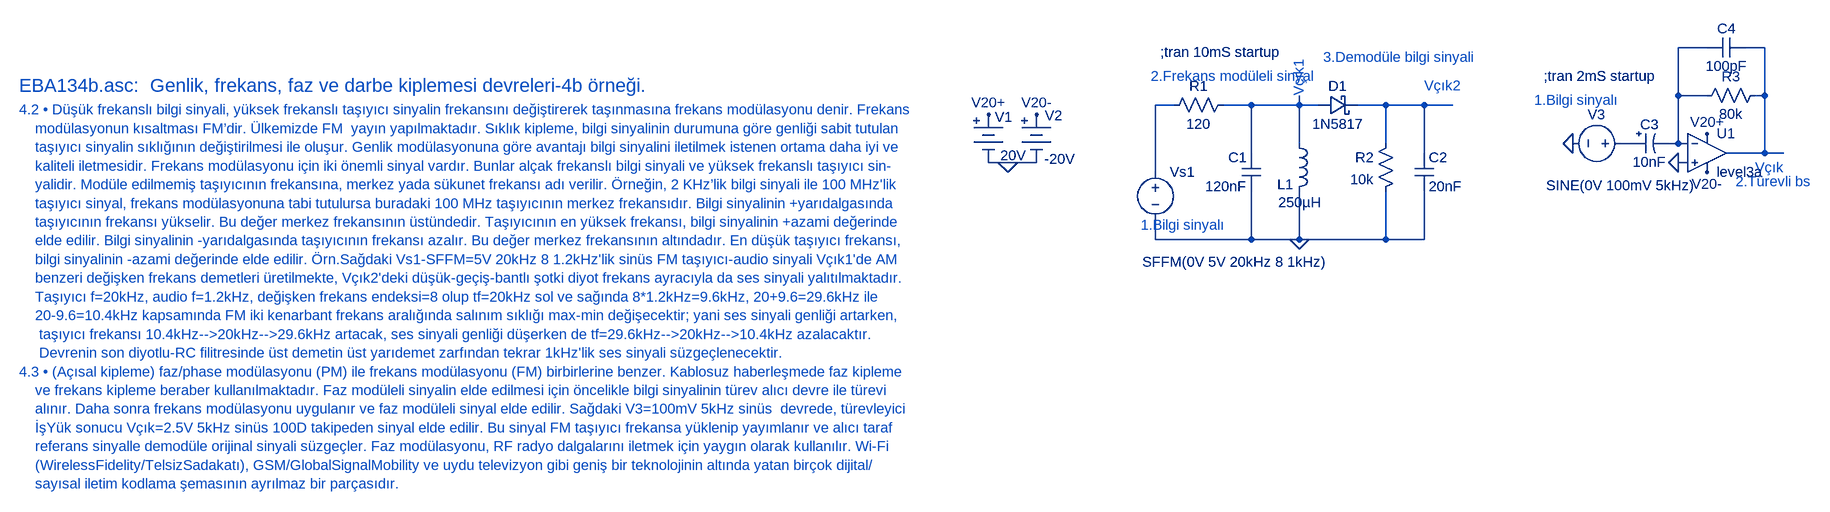
[diagram p0: schematic EBA134b.asc]
EBA134b.asc, the LTspice schematic file:
Version 4
SHEET 1 5332 4332
WIRE 2880 -16 2832 -16
WIRE 2976 -16 2944 -16
WIRE 2832 64 2832 -16
WIRE 2880 64 2832 64
WIRE 2976 64 2976 -16
WIRE 2976 64 2960 64
WIRE 1984 80 1952 80
WIRE 2112 80 2064 80
WIRE 2192 80 2192 64
WIRE 2192 80 2112 80
WIRE 2224 80 2192 80
WIRE 2336 80 2288 80
WIRE 2400 80 2336 80
WIRE 2448 80 2400 80
WIRE 2192 144 2192 80
WIRE 2336 144 2336 80
WIRE 2752 144 2736 144
WIRE 2832 144 2832 64
WIRE 2832 144 2816 144
WIRE 2848 144 2832 144
WIRE 2112 160 2112 80
WIRE 2400 160 2400 80
WIRE 2976 160 2976 64
WIRE 2976 160 2912 160
WIRE 3008 160 2976 160
WIRE 1664 176 1632 176
WIRE 1712 176 1664 176
WIRE 2848 176 2832 176
WIRE 1952 192 1952 80
WIRE 1952 304 1952 272
WIRE 2112 304 2112 224
WIRE 2112 304 1952 304
WIRE 2192 304 2192 224
WIRE 2192 304 2112 304
WIRE 2336 304 2336 224
WIRE 2336 304 2192 304
WIRE 2400 304 2400 224
WIRE 2400 304 2336 304
FLAG 1664 176 0
FLAG 1632 96 V20+
FLAG 1712 96 V20-
FLAG 2192 304 0
FLAG 2656 144 0
FLAG 2832 176 0
FLAG 2880 128 V20+
FLAG 2880 192 V20-
SYMBOL Misc\\battery 1632 80 R0
WINDOW 0 11 20 Left 2
WINDOW 3 20 84 Left 2
SYMATTR InstName V1
SYMATTR Value 20V
SYMBOL Misc\\battery 1712 80 R0
WINDOW 0 14 18 Left 2
WINDOW 3 13 90 Left 2
SYMATTR InstName V2
SYMATTR Value -20V
SYMBOL voltage 1952 176 R0
WINDOW 3 -22 166 Left 2
WINDOW 123 0 0 Left 0
WINDOW 39 0 0 Left 0
SYMATTR Value SFFM(0V 5V 20kHz 8 1kHz)
SYMATTR InstName Vs1
SYMBOL res 2080 64 R90
WINDOW 0 0 56 VBottom 2
WINDOW 3 32 56 VTop 2
SYMATTR InstName R1
SYMATTR Value 120
SYMBOL cap 2128 160 M0
SYMATTR InstName C1
SYMATTR Value 120nF
SYMBOL ind 2176 128 R0
WINDOW 0 -21 85 Left 2
WINDOW 3 -19 115 Left 2
SYMATTR InstName L1
SYMATTR Value 250µH
SYMBOL res 2352 128 M0
SYMATTR InstName R2
SYMATTR Value 10k
SYMBOL cap 2384 160 R0
SYMATTR InstName C2
SYMATTR Value 20nF
SYMBOL schottky 2224 64 M90
WINDOW 0 0 32 VBottom 2
WINDOW 3 32 32 VTop 2
SYMATTR InstName D1
SYMATTR Value 1N5817
SYMATTR Description Diode
SYMATTR Type varactor
SYMBOL OpAmps\\UniversalOpAmp3 2880 160 R0
SYMATTR InstName U1
SYMBOL polcap 2752 128 M90
WINDOW 0 0 32 VBottom 2
WINDOW 3 32 32 VTop 2
SYMATTR InstName C3
SYMATTR Value 10nF
SYMBOL voltage 2752 144 R90
WINDOW 0 -32 56 VBottom 2
WINDOW 3 86 17 VBottom 2
WINDOW 123 0 0 Left 0
WINDOW 39 0 0 Left 0
SYMATTR InstName V3
SYMATTR Value SINE(0V 100mV 5kHz)
SYMBOL res 2976 48 R90
WINDOW 0 0 56 VBottom 2
WINDOW 3 32 56 VTop 2
SYMATTR InstName R3
SYMATTR Value 80k
SYMBOL cap 2944 -32 R90
WINDOW 0 0 32 VBottom 2
WINDOW 3 32 32 VTop 2
SYMATTR InstName C4
SYMATTR Value 100pF
TEXT -224 48 Left 3 ;EBA134b.asc:  Genlik, frekans, faz ve darbe kiplemesi devreleri-4b örneği.
TEXT -224 88 Left 2 ;4.2 • Düşük frekanslı bilgi sinyali, yüksek frekanslı taşıyıcı sinyalin frekansını değiştirerek taşınmasına frekans modülasyonu denir. Frekans \n    modülasyonun kısaltması FM’dir. Ülkemizde FM  yayın yapılmaktadır. Sıklık kipleme, bilgi sinyalinin durumuna göre genliği sabit tutulan \n    taşıyıcı sinyalin sıklığının değiştirilmesi ile oluşur. Genlik modülasyonuna göre avantajı bilgi sinyalini iletilmek istenen ortama daha iyi ve \n    kaliteli iletmesidir. Frekans modülasyonu için iki önemli sinyal vardır. Bunlar alçak frekanslı bilgi sinyali ve yüksek frekanslı taşıyıcı sin-\n    yalidir. Modüle edilmemiş taşıyıcının frekansına, merkez yada sükunet frekansı adı verilir. Örneğin, 2 KHz’lik bilgi sinyali ile 100 MHz'lik\n    taşıyıcı sinyal, frekans modülasyonuna tabi tutulursa buradaki 100 MHz taşıyıcının merkez frekansıdır. Bilgi sinyalinin +yarıdalgasında\n    taşıyıcının frekansı yükselir. Bu değer merkez frekansının üstündedir. Taşıyıcının en yüksek frekansı, bilgi sinyalinin +azami değerinde\n    elde edilir. Bilgi sinyalinin -yarıdalgasında taşıyıcının frekansı azalır. Bu değer merkez frekansının altındadır. En düşük taşıyıcı frekansı,\n    bilgi sinyalinin -azami değerinde elde edilir. Örn.Sağdaki Vs1-SFFM=5V 20kHz 8 1.2kHz'lik sinüs FM taşıyıcı-audio sinyali Vçık1'de AM\n    benzeri değişken frekans demetleri üretilmekte, Vçık2'deki düşük-geçiş-bantlı şotki diyot frekans ayracıyla da ses sinyali yalıtılmaktadır. \n    Taşıyıcı f=20kHz, audio f=1.2kHz, değişken frekans endeksi=8 olup tf=20kHz sol ve sağında 8*1.2kHz=9.6kHz, 20+9.6=29.6kHz ile \n    20-9.6=10.4kHz kapsamında FM iki kenarbant frekans aralığında salınım sıklığı max-min değişecektir; yani ses sinyali genliği artarken,\n     taşıyıcı frekansı 10.4kHz-->20kHz-->29.6kHz artacak, ses sinyali genliği düşerken de tf=29.6kHz-->20kHz-->10.4kHz azalacaktır.\n     Devrenin son diyotlu-RC filitresinde üst demetin üst yarıdemet zarfından tekrar 1kHz'lik ses sinyali süzgeçlenecektir.\n4.3 • (Açısal kipleme) faz/phase modülasyonu (PM) ile frekans modülasyonu (FM) birbirlerine benzer. Kablosuz haberleşmede faz kipleme\n    ve frekans kipleme beraber kullanılmaktadır. Faz modüleli sinyalin elde edilmesi için öncelikle bilgi sinyalinin türev alıcı devre ile türevi\n    alınır. Daha sonra frekans modülasyonu uygulanır ve faz modüleli sinyal elde edilir. Sağdaki V3=100mV 5kHz sinüs  devrede, türevleyici\n    İşYük sonucu Vçık=2.5V 5kHz sinüs 100D takipeden sinyal elde edilir. Bu sinyal FM taşıyıcı frekansa yüklenip yayımlanır ve alıcı taraf\n    referans sinyalle demodüle orijinal sinyali süzgeçler. Faz modülasyonu, RF radyo dalgalarını iletmek için yaygın olarak kullanılır. Wi-Fi\n    (WirelessFidelity/TelsizSadakatı), GSM/GlobalSignalMobility ve uydu televizyon gibi geniş bir teknolojinin altında yatan birçok dijital/\n    sayısal iletim kodlama şemasının ayrılmaz bir parçasıdır.
TEXT 1960 -8 Left 2 !;tran 10mS startup
TEXT 2400 48 Left 2 ;Vçık2
TEXT 2192 64 VLeft 2 ;Vçık1
TEXT 2960 184 Left 2 ;Vçık
TEXT 2608 32 Left 2 !;tran 2mS startup
TEXT 1928 280 Left 2 ;1.Bilgi sinyalı
TEXT 1944 32 Left 2 ;2.Frekans modüleli sinyal
TEXT 2232 0 Left 2 ;3.Demodüle bilgi sinyali
TEXT 2592 72 Left 2 ;1.Bilgi sinyalı
TEXT 2928 208 Left 2 ;2.Türevli bs

The netlist it stands for:
* EBA134b.asc
V1 V20+ 0 20V
V2 V20- 0 -20V
Vs1 N003 0 SFFM(0V 5V 20kHz 8 1kHz)
R1 N004 N003 120
C1 N004 0 120nF
L1 N004 0 250µH
R2 N005 0 10k
C2 N005 0 20nF
D1 N004 N005 1N5817
XU1 0 N001 V20+ V20- N002 level3a  ; pins In+ In- V+ V- OUT
C3 N006 N001 10nF
V3 N006 0 SINE(0V 100mV 5kHz)
R3 N002 N001 80k
C4 N002 N001 100pF
.model D D
.lib standard.dio
* EBA134b.asc:  Genlik, frekans, faz ve darbe kiplemesi devreleri-4b örneği.
* 4.2 • Düşük frekanslı bilgi sinyali, yüksek frekanslı taşıyıcı sinyalin frekansını değiştirerek taşınmasına frekans modülasyonu denir. Frekans
*     modülasyonun kısaltması FM’dir. Ülkemizde FM  yayın yapılmaktadır. Sıklık kipleme, bilgi sinyalinin durumuna göre genliği sabit tutulan
*     taşıyıcı sinyalin sıklığının değiştirilmesi ile oluşur. Genlik modülasyonuna göre avantajı bilgi sinyalini iletilmek istenen ortama daha iyi ve
*     kaliteli iletmesidir. Frekans modülasyonu için iki önemli sinyal vardır. Bunlar alçak frekanslı bilgi sinyali ve yüksek frekanslı taşıyıcı sin-
*     yalidir. Modüle edilmemiş taşıyıcının frekansına, merkez yada sükunet frekansı adı verilir. Örneğin, 2 KHz’lik bilgi sinyali ile 100 MHz'lik
*     taşıyıcı sinyal, frekans modülasyonuna tabi tutulursa buradaki 100 MHz taşıyıcının merkez frekansıdır. Bilgi sinyalinin +yarıdalgasında
*     taşıyıcının frekansı yükselir. Bu değer merkez frekansının üstündedir. Taşıyıcının en yüksek frekansı, bilgi sinyalinin +azami değerinde
*     elde edilir. Bilgi sinyalinin -yarıdalgasında taşıyıcının frekansı azalır. Bu değer merkez frekansının altındadır. En düşük taşıyıcı frekansı,
*     bilgi sinyalinin -azami değerinde elde edilir. Örn.Sağdaki Vs1-SFFM=5V 20kHz 8 1.2kHz'lik sinüs FM taşıyıcı-audio sinyali Vçık1'de AM
*     benzeri değişken frekans demetleri üretilmekte, Vçık2'deki düşük-geçiş-bantlı şotki diyot frekans ayracıyla da ses sinyali yalıtılmaktadır.
*     Taşıyıcı f=20kHz, audio f=1.2kHz, değişken frekans endeksi=8 olup tf=20kHz sol ve sağında 8*1.2kHz=9.6kHz, 20+9.6=29.6kHz ile
*     20-9.6=10.4kHz kapsamında FM iki kenarbant frekans aralığında salınım sıklığı max-min değişecektir; yani ses sinyali genliği artarken,
*      taşıyıcı frekansı 10.4kHz-->20kHz-->29.6kHz artacak, ses sinyali genliği düşerken de tf=29.6kHz-->20kHz-->10.4kHz azalacaktır.
*      Devrenin son diyotlu-RC filitresinde üst demetin üst yarıdemet zarfından tekrar 1kHz'lik ses sinyali süzgeçlenecektir.
* 4.3 • (Açısal kipleme) faz/phase modülasyonu (PM) ile frekans modülasyonu (FM) birbirlerine benzer. Kablosuz haberleşmede faz kipleme
*     ve frekans kipleme beraber kullanılmaktadır. Faz modüleli sinyalin elde edilmesi için öncelikle bilgi sinyalinin türev alıcı devre ile türevi
*     alınır. Daha sonra frekans modülasyonu uygulanır ve faz modüleli sinyal elde edilir. Sağdaki V3=100mV 5kHz sinüs  devrede, türevleyici
*     İşYük sonucu Vçık=2.5V 5kHz sinüs 100D takipeden sinyal elde edilir. Bu sinyal FM taşıyıcı frekansa yüklenip yayımlanır ve alıcı taraf
*     referans sinyalle demodüle orijinal sinyali süzgeçler. Faz modülasyonu, RF radyo dalgalarını iletmek için yaygın olarak kullanılır. Wi-Fi
*     (WirelessFidelity/TelsizSadakatı), GSM/GlobalSignalMobility ve uydu televizyon gibi geniş bir teknolojinin altında yatan birçok dijital/
*     sayısal iletim kodlama şemasının ayrılmaz bir parçasıdır.
;tran 10mS startup
* Vçık2
* Vçık1
* Vçık
;tran 2mS startup
* 1.Bilgi sinyalı
* 2.Frekans modüleli sinyal
* 3.Demodüle bilgi sinyali
* 1.Bilgi sinyalı
* 2.Türevli bs
.backanno
.end